# EAGLE design board (EAGLE 6.4)
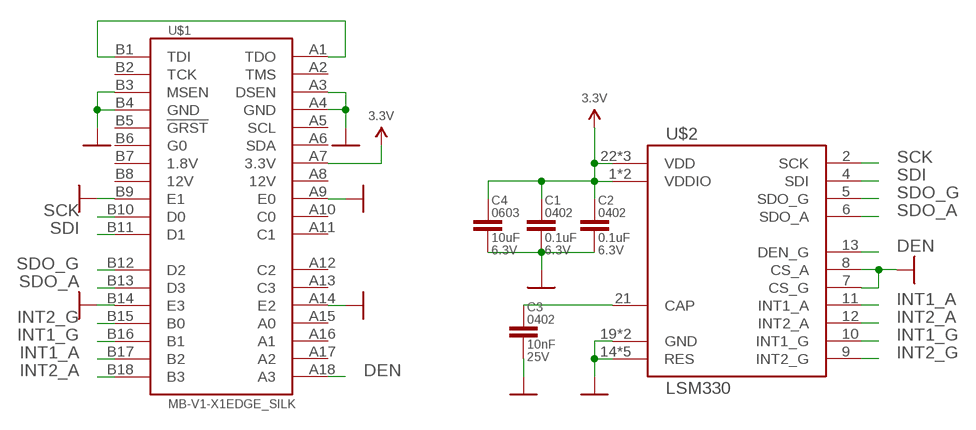
[diagram p0: schematic, sheet 1]

## Parts
C1  0.1uF  CAP0402-CAP  [0402-CAP]
C2  0.1uF  CAP0402-CAP  [0402-CAP]
C3  10nF  CAP0402-CAP  [0402-CAP]
C4  10uF  CAP0603  [0603-CAP]
U$1  MB-V1-X1EDGE_SILK  [MB-V1-X1-EDGE]
U$2  LSM330  [LSM330]

## Nets
3.3V: C1.1 C2.1 C4.1 U$1.A7(3.3V) U$2.1(VDDIO) U$2.3(VDDIO) U$2.22(VDD) U$2.23(VDD) U$2.24(VDD)
CAP: C3.1 U$2.21(CAP)
DEN: U$1.A18(A3) U$2.13(DEN_G)
GND: C1.2 C2.2 C3.2 C4.2 U$1.A3(DSEN) U$1.A4(GND) U$1.A9(E0) U$1.A14(E2) U$1.B3(MSEN) U$1.B4(GND) U$1.B9(E1) U$1.B14(E3) U$2.7(CS_G) U$2.8(CS_A) U$2.14(RES) U$2.15(RES) U$2.16(RES) U$2.17(RES) U$2.18(RES) U$2.19(GND) U$2.20(GND)
INT1_A: U$1.B17(B2) U$2.11(INT1_A)
INT1_G: U$1.B16(B1) U$2.10(INT1_G)
INT2_A: U$1.B18(B3) U$2.12(INT2_A)
INT2_G: U$1.B15(B0) U$2.9(INT2_G)
N$1: U$1.A1(TDO) U$1.B1(TDI)
SCK: U$1.B10(D0) U$2.2(SCK)
SDI: U$1.B11(D1) U$2.4(SDI)
SDO_A: U$1.B13(D3) U$2.6(SDO_A)
SDO_G: U$1.B12(D2) U$2.5(SDO_G)
Unconnected: U$1.A2(TMS) U$1.A5(SCL) U$1.A6(SDA) U$1.A8(12V) U$1.A10(C0) U$1.A11(C1) U$1.A12(C2) U$1.A13(C3) U$1.A15(A0) U$1.A16(A1) U$1.A17(A2) U$1.B2(TCK) U$1.B5(!GRST) U$1.B6(G0) U$1.B7(1.8V) U$1.B8(12V)

## Library data of the parts
C1 C2 = kmod-passives:CAP: Capacitor Standard 0603 ceramic capacitor, and 0.1" leaded capacitor.; PACKAGE: 0402; VOLTAGE: 6.3V
C3 = kmod-passives:CAP: Capacitor Standard 0603 ceramic capacitor, and 0.1" leaded capacitor.; PACKAGE: 0402; VOLTAGE: 25V
C4 = kmod-passives:CAP: Capacitor Standard 0603 ceramic capacitor, and 0.1" leaded capacitor.; PACKAGE: 0603; VOLTAGE: 6.3V
U$1 = kmod-connectors:MB-V1-X1
U$2 = kmod-testing:LSM330: 6-axis accel + gyro http://www.digikey.com/product-detail/en/LSM330TR/497-14381-1-ND/4725838 http://www.st.com/web/en/resource/technical/document/datasheet/DM00059856.pdf Note: NOT LSM330D

## Board
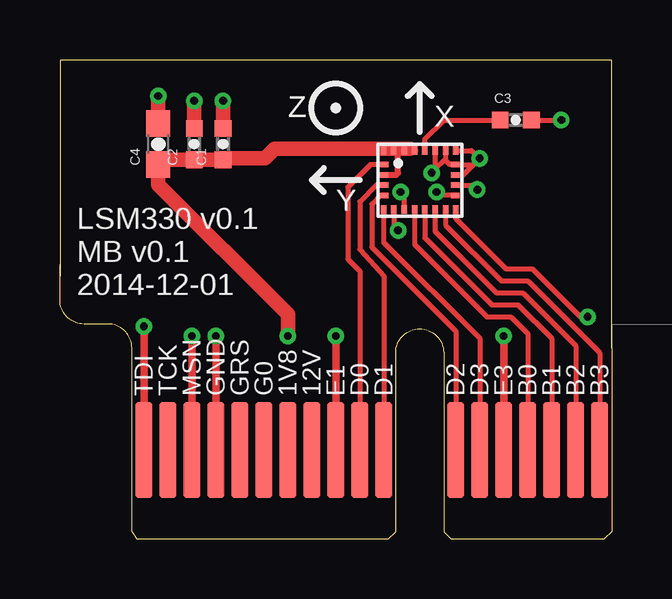
[diagram p1: board, top side]
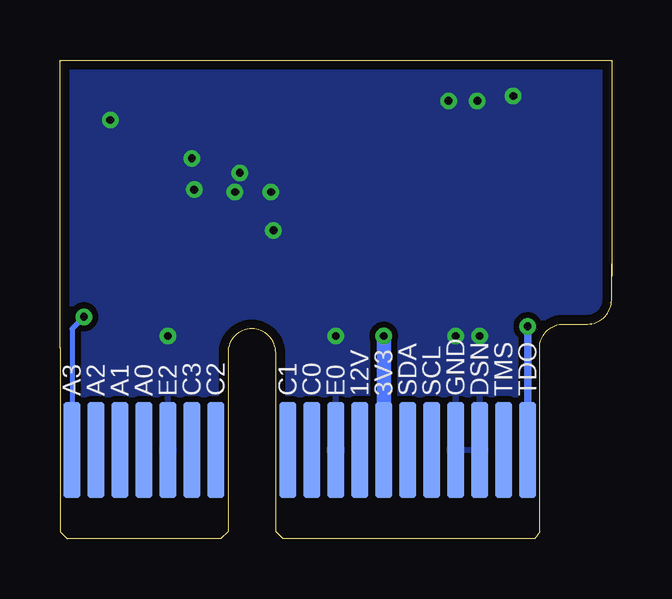
[diagram p2: board, bottom side, seen from below]

Size 23 x 19.95 mm. Coordinates in mm from the lower left corner, seen from the top.
Outline: 23,7.95 23,19.95 0,19.95 0,10.95
Copper layers (1*16): Top 0.0356mm / dielectric 1.5011mm / Bottom 0.0356mm
Design rules "OSHPark_mine": minimum track width 6mil, minimum drill 13mil, track to track 6mil, track to pad 6mil, pad to pad 6mil, via to via 6mil, smd to smd 6mil, copper to edge 15mil, drill to drill 6mil, minimum pad ring 7mil, minimum via ring 7mil, stop-mask expansion 2mil, vias tented up to drill 13mil, thermal gap 10mil

### Footprints (pad centres in the part's own frame; a part is rotated, then mirrored left to right if it is on the bottom)
0402-CAP = smd 0.7 x 0.7: 1 -0.65,0; 2 0.65,0
0603-CAP = smd 1.1 x 1: 1 -0.85,0; 2 0.85,0
MB-V1-X1-EDGE = smd 0.7 x 4 bottom: A1 -11.5,-0.75; A2 -10.5,-0.75; A3 -9.5,-0.75; A4 -8.5,-0.75; A5 -7.5,-0.75; A6 -6.5,-0.75; A7 -5.5,-0.75; A8 -4.5,-0.75; A9 -3.5,-0.75; A10 -2.5,-0.75; A11 -1.5,-0.75; A12 1.5,-0.75; A13 2.5,-0.75; A14 3.5,-0.75; A15 4.5,-0.75; A16 5.5,-0.75; A17 6.5,-0.75; A18 7.5,-0.75 | smd 0.7 x 4: B1 -11.5,-0.75; B2 -10.5,-0.75; B3 -9.5,-0.75; B4 -8.5,-0.75; B5 -7.5,-0.75; B6 -6.5,-0.75; B7 -5.5,-0.75; B8 -4.5,-0.75; B9 -3.5,-0.75; B10 -2.5,-0.75; B11 -1.5,-0.75; B12 1.5,-0.75; B13 2.5,-0.75; B14 3.5,-0.75; B15 4.5,-0.75; B16 5.5,-0.75; B17 6.5,-0.75; B18 7.5,-0.75
LSM330 = smd 0.23 x 0.35: 1 -1.505,1.225; 6 -1.505,-1.225; 7 -1.075,-1.225; 8 -0.645,-1.225; 9 -0.215,-1.225; 10 0.215,-1.225; 11 0.645,-1.225; 12 1.075,-1.225; 13 1.505,-1.225; 18 1.505,1.225; 19 1.075,1.225; 20 0.645,1.225; 21 0.215,1.225; 22 -0.215,1.225; 23 -0.645,1.225; 24 -1.075,1.225 | smd 0.35 x 0.23: 2 -1.475,0.645; 3 -1.475,0.215; 4 -1.475,-0.215; 5 -1.475,-0.645; 14 1.475,-0.645; 15 1.475,-0.215; 16 1.475,0.215; 17 1.475,0.645

### Placement (x,y rotation side)
C1  6.8,16.45 90 top
C2  5.6,16.45 90 top
C3  19,17.45 0 top
C4  4.1,16.45 90 top
U$1  15,4.45 0 top
U$2  15,14.95 0 top

### Tracks (layer width: path | path; a pad name or v marks a point on that pad's centre or on a via)
3.3V  (via drill 0.33)
  Top 0.254: U$2.3 14.02,15.16 14.1,15.25 14.1,16 U$2.24
  Top 0.305: U$2.1 13.57,16.25 13.6,16.25 | U$2.24 13.9,16.2 13.9,16.25 | U$2.23 14.3,16.23 14.3,16.25 | 14.6,16.25 14.68,16.18 U$2.22
  Top 0.61: v9.5,8.45 9.5,9.35 4.1,14.75 C4.1 4.3,15.8 C2.1 C1.1 6.8,15.85 8.55,15.85 8.95,16.25 13.6,16.25 13.9,16.25 14.3,16.25 14.6,16.25
  Bottom 0.61: U$1.A7 v9.5,8.45
CAP
  Top 0.203: U$2.21 15.21,16.66 16,17.45 C3.1
DEN  (via drill 0.33)
  Top 0.203: U$2.13 16.5,13.34 18.6,11.25 19.7,11.25 21.7,9.25 v22,9.25
  Bottom 0.203: v22,9.25 22.5,8.75 U$1.A18
GND  (via drill 0.33)
  Top 0.203: U$2.7 13.93,13.02 v14.1,12.85 | U$2.8 14.36,14.3 v14.2,14.45 | C3.2 19.7,17.5 19.75,17.45 v20.9,17.45 | U$2.20 15.64,15.39 | 15.64,15.39 v15.5,15.25 | U$2.19 16.07,15.82 15.64,15.39 | U$2.18 17.18,16.18 v17.5,15.85 17.25,15.59 | 17.25,15.59 U$2.17 16.25,15.59 16.1,15.75 | U$2.14 15.85,14.3 v15.7,14.45 | U$2.15 17.21,14.73 v17.4,14.55 | U$2.16 16.82,15.16 17.25,15.59
  Top 0.305: U$1.B3 v5.5,8.45 | U$1.B4 v6.5,8.45 | U$1.A9 v11.5,8.45 | U$1.A14 v18.5,8.45
  Top 0.61: C2.2 v5.6,18.25 | C1.2 v6.8,18.25 | C4.2 v4.1,18.45
  pour Bottom (isolate 0.254): -1,20.95 24,20.95 24,1.95 -1,1.95
INT1_A
  Top 0.203: U$2.11 15.64,12.8 18.2,10.25 19.3,10.25 21.5,8.05 U$1.B17
INT1_G
  Top 0.203: U$2.10 15.21,12.54 18,9.75 19.1,9.75 20.5,8.35 U$1.B16
INT2_A
  Top 0.203: U$2.12 16.07,13.07 18.4,10.75 19.5,10.75 22.5,7.75 U$1.B18
INT2_G
  Top 0.203: U$2.9 14.79,12.27 17.8,9.25 18.8,9.25 19.5,8.55 U$1.B15
N$1  (via drill 0.33)
  Top 0.305: v3.5,8.85 U$1.B1
  Bottom 0.305: U$1.B1 v3.5,8.85
SCK
  Top 0.203: U$2.2 12.95,15.59 12,14.65 12,11.65 12.5,11.15 U$1.B10
SDI
  Top 0.203: U$2.4 13.19,14.73 12.5,14.05 12.5,12.05 13.5,10.95 U$1.B11
SDO_A
  Top 0.203: U$2.6 13.49,12.36 17.5,8.35 U$1.B13
SDO_G
  Top 0.203: U$2.5 13.36,14.3 13,13.95 13,12.15 16.5,8.65 U$1.B12

### Text on the board
tPlace: LSM330 v0.1 / MB v0.1 / 2014-12-01